# EAGLE design irrigator (EAGLE 8.0.0)
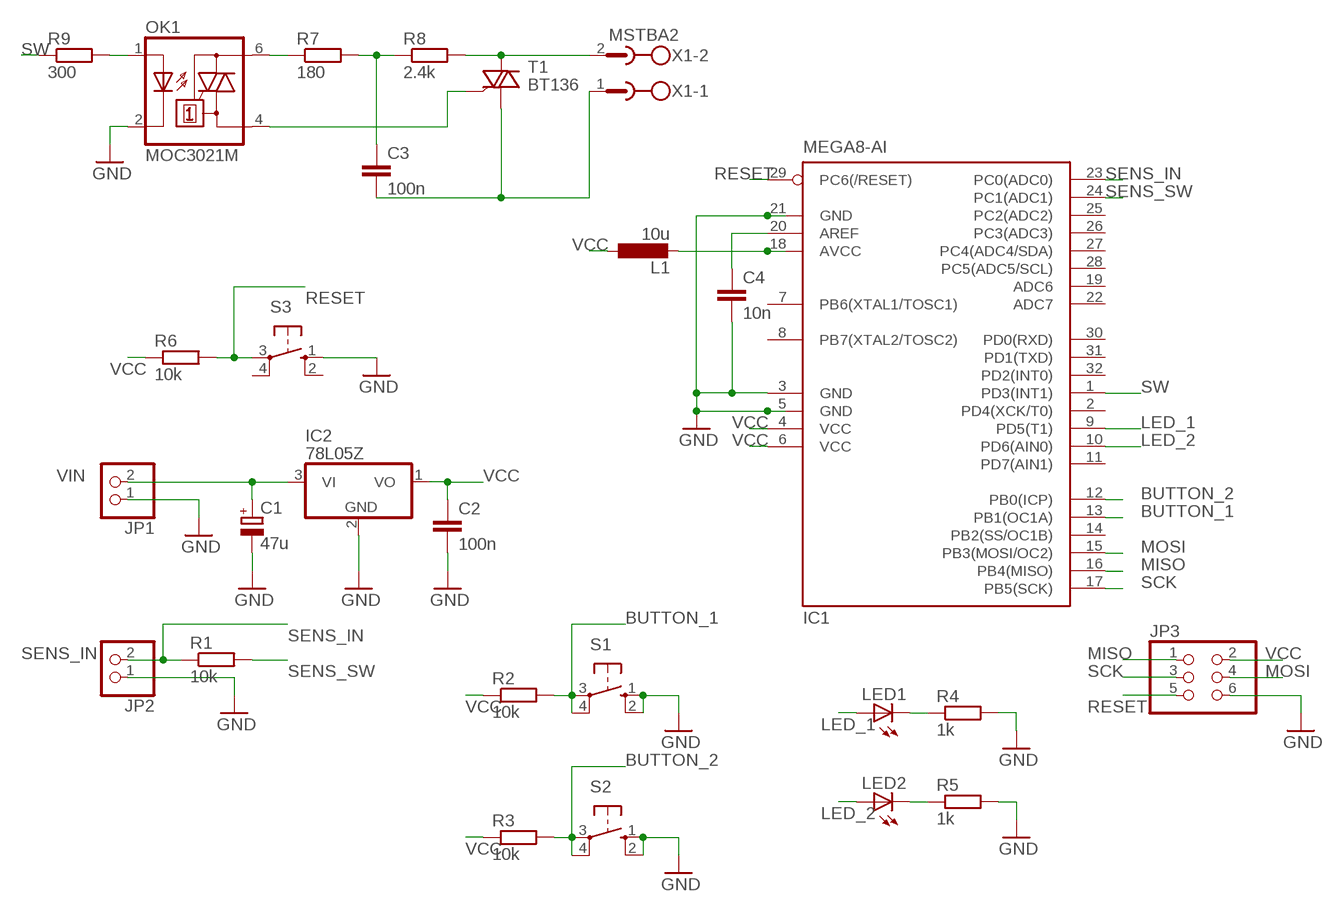
[diagram p0: schematic, sheet 1]

## Parts
C1  47u  CPOL-EUE2,5-6E  [E2,5-6E]
C2  100n  C-EUC1206  [C1206]
C3  100n  C-EUC1206  [C1206]
C4  10n  C-EUC1206  [C1206]
IC1  MEGA8-AI  [TQFP32-08]
IC2  78L05Z  [TO92]
JP1  PINHD-1X2  [1X02]
JP2  PINHD-1X2  [1X02]
JP3  PINHD-2X3  [2X03]
L1  10u  L-EUL3216C  [L3216C]
LED1  LED5MM  [LED5MM]
LED2  LED5MM  [LED5MM]
OK1  MOC3021M  [DIL06]
R1  10k  R-EU_R1206  [R1206]
R2  10k  R-EU_R1206  [R1206]
R3  10k  R-EU_R1206  [R1206]
R4  1k  R-EU_R1206  [R1206]
R5  1k  R-EU_R1206  [R1206]
R6  10k  R-EU_R1206  [R1206]
R7  180  R-EU_R1206  [R1206]
R8  2.4k  R-EU_R1206  [R1206]
R9  300  R-EU_R1206  [R1206]
S1  10-XX  [B3F-10XX]
S2  10-XX  [B3F-10XX]
S3  10-XX  [B3F-10XX]
T1  BT136  [TO220AB]
X1  MSTBA2  [MSTBA2]

## Nets
BUTTON_1: IC1.13(PB1(OC1A)) R2.2 S1.3(P) S1.4(P1)
BUTTON_2: IC1.12(PB0(ICP)) R3.2 S2.3(P) S2.4(P1)
GND: C1.- C2.2 C4.2 IC1.3(GND) IC1.5(GND) IC1.21(GND) IC2.2(GND) JP1.1 JP2.1 JP3.6 OK1.2(C) R4.2 R5.2 S1.1(S) S1.2(S1) S2.1(S) S2.2(S1) S3.1(S)
LED_1: IC1.9(PD5(T1)) LED1.A
LED_2: IC1.10(PD6(AIN0)) LED2.A
MISO: IC1.16(PB4(MISO)) JP3.1
MOSI: IC1.15(PB3(MOSI/OC2)) JP3.4
N$1: OK1.1(A) R9.2
N$2: LED1.K(C) R4.1
N$3: LED2.K(C) R5.1
N$4: OK1.6(A2) R7.1
N$5: C3.1 R7.2 R8.1
N$6: OK1.4(A1) T1.3(G)
N$7: R8.2 T1.2(A2) X1.2
N$8: C3.2 T1.1(A1) X1.1
N$9: C4.1 IC1.20(AREF)
N$10: IC1.18(AVCC) L1.2
RESET: IC1.29(PC6(/RESET)) JP3.5 R6.2 S3.3(P)
SCK: IC1.17(PB5(SCK)) JP3.3
SENS_IN: IC1.23(PC0(ADC0)) JP2.2 R1.1
SENS_SW: IC1.24(PC1(ADC1)) R1.2
SW: IC1.1(PD3(INT1)) R9.1
VCC: C2.1 IC1.4(VCC) IC1.6(VCC) IC2.1(VO) JP3.2 L1.1 R2.1 R3.1 R6.1
VIN: C1.+ IC2.3(VI) JP1.2
Unconnected: IC1.2(PD4(XCK/T0)) IC1.7(PB6(XTAL1/TOSC1)) IC1.8(PB7(XTAL2/TOSC2)) IC1.11(PD7(AIN1)) IC1.14(PB2(SS/OC1B)) IC1.19(ADC6) IC1.22(ADC7) IC1.25(PC2(ADC2)) IC1.26(PC3(ADC3)) IC1.27(PC4(ADC4/SDA)) IC1.28(PC5(ADC5/SCL)) IC1.30(PD0(RXD)) IC1.31(PD1(TXD)) IC1.32(PD2(INT0)) S3.2(S1) S3.4(P1)

## Library data of the parts
C1 = rcl:CPOL-EU: POLARIZED CAPACITOR, European symbol
C2-C4 = rcl:C-EU: CAPACITOR, European symbol
IC1 = atmel:MEGA8: MICROCONTROLLER 8 Kbytes FLASH, 1 kbytes SRAM, 512 bytes EEPROM, USART, 6-channel 10 bit ADC, 2-channel 8 bit ADC Pin compatible with Atmega48, ATMega88, ATMega168 Source: avr.lbr; MPN: ATMEGA8-16AU; OC_FARNELL: 9171371; OC_NEWARK: 73M8863
IC2 = linear:78*: Positive VOLTAGE REGULATOR Source: http://cache.national.com/ds/LM/LM78L05.pdf http://www.fairchildsemi.com/ds/LM/LM7805.pdf
JP1 JP2 = pinhead:PINHD-1X2: PIN HEADER
JP3 = pinhead:PINHD-2X3: PIN HEADER
L1 = rcl:L-EU: INDUCTOR, European symbol
LED1 LED2 = led:LED: LED OSRAM: - CHIPLED LG R971, LG N971, LY N971, LG Q971, LY Q971, LO R971, LY R971 LH N974, LH R974 LS Q976, LO Q976, LY Q976 LO Q996 - Hyper CHIPLED LW Q18S LB Q993, LB Q99A, LB R99A - SideLED LS A670, LO A670, LY A670, LG A670, LP A670 LB A673, LV A673, LT A673, LW A673 LH A674 LY A675 LS A676, LA A676, LO A676, LY A676, LW A676 LS A679, LY A679, LG A679 - Hyper Micro SIDELED® LS Y876, LA Y876, LO Y876, LY Y876 LT Y87S - SmartLED LW L88C, LW L88S LB L89C, LB L89S, LG L890 LS L89K, LO L89K, LY L89K LS L896, LA L896, LO L896, LY L896 - TOPLED LS T670, LO T670, LY T670, LG T670, LP T670 LSG T670, LSP T670, LSY T670, LOP T670, LYG T670 LG T671, LOG T671, LSG T671 LB T673, LV T673, LT T673, LW T673 LH T674 LS T676, LA T676, LO T676, LY T676, LB T676, LH T676, LSB T676, LW T676 LB T67C, LV T67C, LT T67C, LS T67K, LO T67K, LY T67K, LW E67C LS E67B, LA E67B, LO E67B, LY E67B, LB E67C, LV E67C, LT E67C LW T67C LS T679, LY T679, LG T679 LS T770, LO T770, LY T770, LG T770, LP T770 LB T773, LV T773, LT T773, LW T773 LH T774 LS E675, LA E675, LY E675, LS T675 LS T776, LA T776, LO T776, LY T776, LB T776 LHGB T686 LT T68C, LB T68C - Hyper Mini TOPLED® LB M676 - Mini TOPLED Santana® LG M470 LS M47K, LO M47K, LY M47K Source: http://www.osram.convergy.de LUXEON: - LUMILED® LXK2-PW12-R00, LXK2-PW12-S00, LXK2-PW14-U00, LXK2-PW14-V00 LXK2-PM12-R00, LXK2-PM12-S00, LXK2-PM14-U00 LXK2-PE12-Q00, LXK2-PE12-R00, LXK2-PE12-S00, LXK2-PE14-T00, LXK2-PE14-U00 LXK2-PB12-K00, LXK2-PB12-L00, LXK2-PB12-M00, LXK2-PB14-N00, LXK2-PB14-P00, LXK2-PB14-Q00 LXK2-PR12-L00, LXK2-PR12-M00, LXK2-PR14-Q00, LXK2-PR14-R00 LXK2-PD12-Q00, LXK2-PD12-R00, LXK2-PD12-S00 LXK2-PH12-R00, LXK2-PH12-S00 LXK2-PL12-P00, LXK2-PL12-Q00, LXK2-PL12-R00 Source: www.luxeon.com KINGBRIGHT: KA-3528ASYC Source: www.kingbright.com
OK1 = optocoupler:MOC30*M: RANDOM-PHASE OPTOISOLATORS TRIAC DRIVER OUTPUT Source: http://www.fairchildsemi.com MOC3020-M.pdf; MF: FAIRCHILD SEMICONDUCTOR; MPN: MOC3021-M; OC_FARNELL: 1021365; OC_NEWARK: 95B7895
R1-R9 = resistor:R-EU_: RESISTOR, European symbol
S1-S3 = switch-omron:10-XX: OMRON SWITCH; MPN: B3F-1000; OC_FARNELL: 176432; OC_NEWARK: 36M3542
T1 = triac:BT136: Triac BT136 series E sensitive gate Source: http://www.nxp.com/acrobat_download/datasheets/BT136_SERIES_E_2.pdf
X1 = con-phoenix-508:MSTBA2: PHOENIX; MF: FARNELL; MPN: 1757242; OC_FARNELL: 3705171; OC_NEWARK: 71C4161

## Board
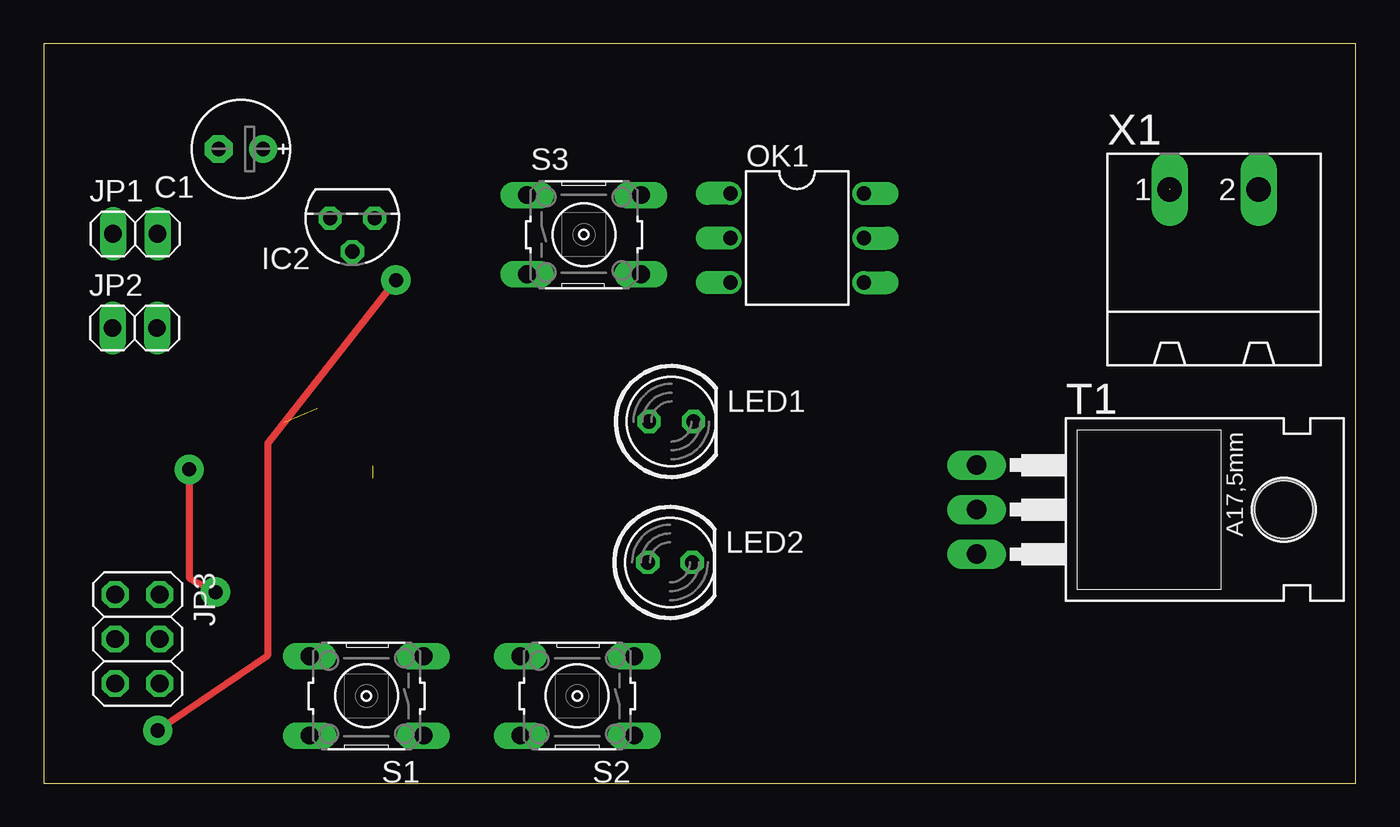
[diagram p1: board, top side]
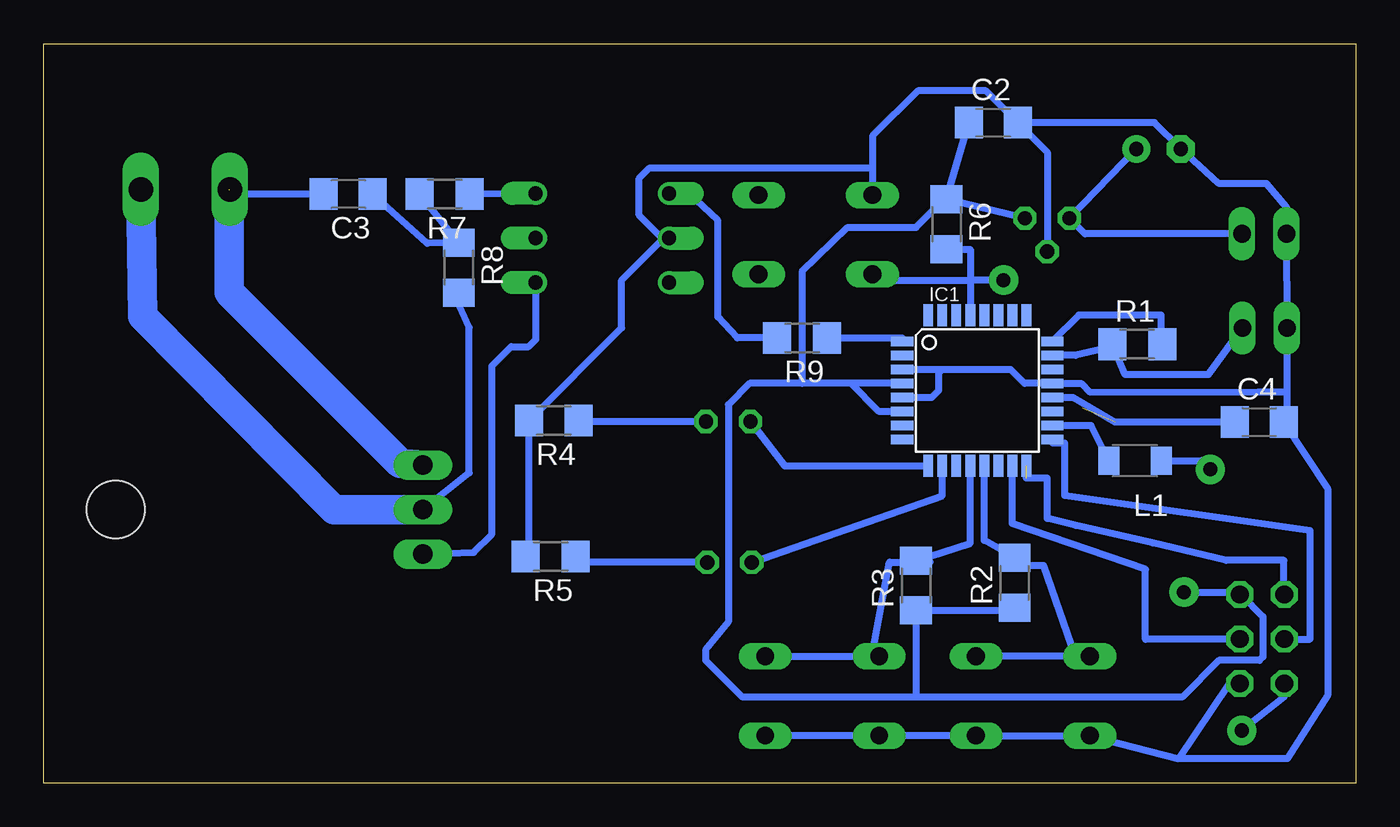
[diagram p2: board, bottom side, seen from below]

Size 74.88 x 42.18 mm. Coordinates in mm from the lower left corner, seen from the top.
Outline: 0,0 74.88,0 74.88,42.18 0,42.18 0,0
Copper layers (1*16): Top 0.035mm / dielectric 1.5mm / Bottom 0.035mm
Design rules "default": minimum track width 10mil, minimum drill 24mil, track to track 8mil, track to pad 8mil, pad to pad 8mil, via to via 8mil, smd to smd 8mil, copper to edge 40mil, drill to drill 8mil, minimum pad ring 10mil, minimum via ring 8mil, stop-mask expansion 4mil, vias tented up to drill 0mil, thermal gap 10mil

### Footprints (pad centres in the part's own frame; a part is rotated, then mirrored left to right if it is on the bottom)
E2,5-6E = drill 0.813 pad 1.575: + -1.27,0 | drill 0.813 pad 1.575 octagon: - 1.27,0
C1206 = smd 1.6 x 1.8: 1 -1.4,0; 2 1.4,0
TQFP32-08 = smd 1.27 x 0.559: 1 -4.293,2.8; 2 -4.293,2; 3 -4.293,1.2; 4 -4.293,0.4; 5 -4.293,-0.4; 6 -4.293,-1.2; 7 -4.293,-2; 8 -4.293,-2.8; 17 4.293,-2.8; 18 4.293,-2; 19 4.293,-1.2; 20 4.293,-0.4; 21 4.293,0.4; 22 4.293,1.2; 23 4.293,2; 24 4.293,2.8 | smd 0.559 x 1.27: 9 -2.8,-4.293; 10 -2,-4.293; 11 -1.2,-4.293; 12 -0.4,-4.293; 13 0.4,-4.293; 14 1.2,-4.293; 15 2,-4.293; 16 2.8,-4.293; 25 2.8,4.293; 26 2,4.293; 27 1.2,4.293; 28 0.4,4.293; 29 -0.4,4.293; 30 -1.2,4.293; 31 -2,4.293; 32 -2.8,4.293
TO92 = drill 0.813 octagon: 1 -1.27,0; 2 0,1.905; 3 1.27,0
1X02 = drill 1.016 long: 1 -1.27,0; 2 1.27,0
2X03 = drill 1.016 octagon: 1 -2.54,-1.27; 2 -2.54,1.27; 3 0,-1.27; 4 0,1.27; 5 2.54,-1.27; 6 2.54,1.27
L3216C = smd 1.2 x 1.6: 1 -1.5,0; 2 1.5,0
LED5MM = drill 0.813 octagon: A -1.27,0; K 1.27,0
DIL06 = drill 0.813 offset: 1 -2.54,-3.81; 2 0,-3.81; 3 2.54,-3.81; 4 2.54,3.81; 5 0,3.81; 6 -2.54,3.81
R1206 = smd 1.6 x 1.803: 1 -1.422,0; 2 1.422,0
B3F-10XX = drill 1.016 long: 1 -3.251,2.261; 2 3.251,2.261; 3 -3.251,-2.261; 4 3.251,-2.261
TO220AB = drill 1.118 long: 1 -2.54,-6.35; 2 0,-6.35; 3 2.54,-6.35 | hole 3.302: 0,11.176
MSTBA2 = drill 1.397 long: 1 -2.54,5.08; 2 2.54,5.08

### Placement (x,y rotation side)
C1  11.25,36.18 180 top
C2  20.69,37.68 0 bottom
C3  57.5,33.6 180 bottom
C4  5.5,20.6 0 bottom
IC1  21.6,22.4 0 bottom
IC2  17.61,32.23 180 top
JP1  5.22,31.34 0 top
JP2  5.19,25.96 0 top
JP3  5.35,8.22 270 top
L1  12.6,18.4 180 bottom
LED1  35.82,20.63 0 top
LED2  35.74,12.59 0 top
OK1  43,31.1 270 top
R1  12.47,25.04 0 bottom
R2  19.46,11.43 90 bottom
R3  25.1,11.27 90 bottom
R4  45.77,20.68 180 bottom
R5  45.95,12.92 180 bottom
R6  23.36,31.88 270 bottom
R7  52,33.6 180 bottom
R8  51.2,29.4 270 bottom
R9  31.6,25.4 180 bottom
S1  18.42,4.97 180 top
S2  30.45,4.97 180 top
S3  30.83,31.29 0 top
T1  59.6,15.6 270 top
X1  66.8,28.8 0 top

### Tracks (layer width: path | path; a pad name or v marks a point on that pad's centre or on a via)
BUTTON_1
  Bottom 0.406: IC1.13 21.2,13.85 R2.2 19.46,12.4 17.8,12.4 16,7.23 | S1.4 16,7.23 | 16,7.23 S1.3
BUTTON_2
  Bottom 0.406: IC1.12 22,13.69 R3.2 24.3,12.6 26.6,12.6 27.6,7.23 | S2.3 27.6,7.23 | 27.6,7.23 S2.4
GND
  Bottom 0.406: S2.1 S2.2 S1.1 S1.2 10.1,1.4 | 10.1,1.4 7.22,5.68 JP3.6 | R5.2 47.19,12.9 R4.2 41.9,25.97 41.9,28.7 39.5,31.1 OK1.2 39.6,31.1 40.9,32.4 40.9,34.5 40.3,35.1 27.58,35.1 | 10.1,1.4 3.9,1.4 1.6,5 1.6,16.8 C4.2 3.92,20.78 3.92,22.3 | C2.2 11.48,37.68 C1.- 7.8,34.2 5.1,34.2 3.95,32.85 JP1.1 JP2.1 3.92,22.3 | C2.2 17.61,36 IC2.2 | C2.2 21.1,39.49 21.1,39.5 25,39.5 27.58,36.92 27.58,35.1 | 27.58,35.1 S3.1 | IC1.3 23.6,23.6 | 23.6,23.6 19.7,23.6 18.9,22.8 IC1.21 15.66,22.8 15.16,22.3 5.58,22.32 3.94,22.32 3.92,22.3 | IC1.5 24.2,22 23.8,22.4 23.8,23.4 23.6,23.6
LED_1
  Bottom 0.406: LED1.A 32.6,18.1 IC1.9
LED_2
  Bottom 0.406: LED2.A 23.6,16.4 IC1.10
MISO  (1 unrouted)
  Bottom 0.406: JP3.1 4.1,10.76 4.1,12.7 7.4,12.7 11.6,13.7 16,14.7 17.6,15.1 17.6,17.4 18.8,17.4
MOSI
  Bottom 0.406: JP3.4 12,8.2 12,12.2 19.6,14.8 IC1.15
N$1
  Bottom 0.406: R9.2 35.3,25.4 36.4,26.6 36.4,32.1 38.04,33.64 OK1.1
N$2
  Bottom 0.406: LED1.K 44.3,20.63 R4.1
N$3
  Bottom 0.406: 44.11,12.52 R5.1 44.2,12.59 LED2.K
N$4
  Bottom 0.406: OK1.6 R7.1
N$5
  Bottom 0.406: R7.2 R8.1 53,30.8 C3.1
N$6
  Bottom 0.406: OK1.4 46.81,25.3 47.21,24.9 48.2,24.9 49.3,23.8 49.3,14.2 50.34,13.16 T1.3
N$7
  Bottom 0.406: T1.2 50.6,17.7 50.6,26 51.4,27.78 R8.2
  Bottom 1.676: X1.2 69.24,26.64 58.3,15.6 T1.2
N$8  (1 unrouted)
  Bottom 0.406: C3.2 63.76,33.6 X1.1
  Bottom 1.676: 64.3,33.84 64.3,28 54.54,18.24 T1.1
N$9  (1 unrouted)
  Bottom 0.406: C4.1 13.73,20.59 16.14,22 IC1.20
N$10
  Bottom 0.406: L1.2 15.1,20.4 IC1.18
RESET  (via drill 0.8 pad 1.68)
  Top 0.406: v6.5,3 12.8,7.3 12.8,19.4 v20.1,28.7
  Bottom 0.406: R6.2 22,30.46 22,28.7 | 22,28.7 IC1.29 | S3.3 26.95,28.7 22,28.7 | JP3.5 4.08,4.92 v6.5,3 | v20.1,28.7 22,28.7
SCK
  Bottom 0.406: JP3.3 2.6,8.22 2.6,14.4 16.6,16.4 16.6,19.4 17.31,19.4 IC1.17
SENS_IN
  Bottom 0.406: IC1.23 16,24.4 13.9,24.9 R1.1 13.19,23.36 13.15,23.3 8.4,23.3 JP2.2
SENS_SW
  Bottom 0.406: R1.2 11.1,25.04 11.1,26.7 15.81,26.7 IC1.24
SW
  Bottom 0.406: R9.1 25.89,25.4 IC1.1
VCC  (via drill 0.8 pad 1.68)
  Top 0.406: v8.3,17.9 8.3,11.7 v9.8,10.9
  Bottom 0.406: IC2.1 R6.1 | R6.1 C2.1 | R6.1 23.5,33.3 25.1,31.7 29,31.7 31.6,29.2 31.6,22.8 | 25.2,4.9 9.9,4.9 7.8,7 5.5,7 5.3,7.2 5.3,9.5 6.56,10.76 JP3.2 6.76,10.9 v9.8,10.9 | 25.2,4.9 35,4.9 37.1,7 37.1,7.6 35.8,9.2 35.8,21.6 34.6,22.8 31.6,22.8 | 25.2,4.9 25.1,5 R3.1 19.62,9.85 R2.1 | L1.1 8.8,18.4 v8.3,17.9 | IC1.4 28.8,22.8 | 28.8,22.8 31.6,22.8 | IC1.6 27.2,21.2 28.8,22.8
VIN
  Bottom 0.406: C1.+ IC2.3 15.45,31.34 JP1.2